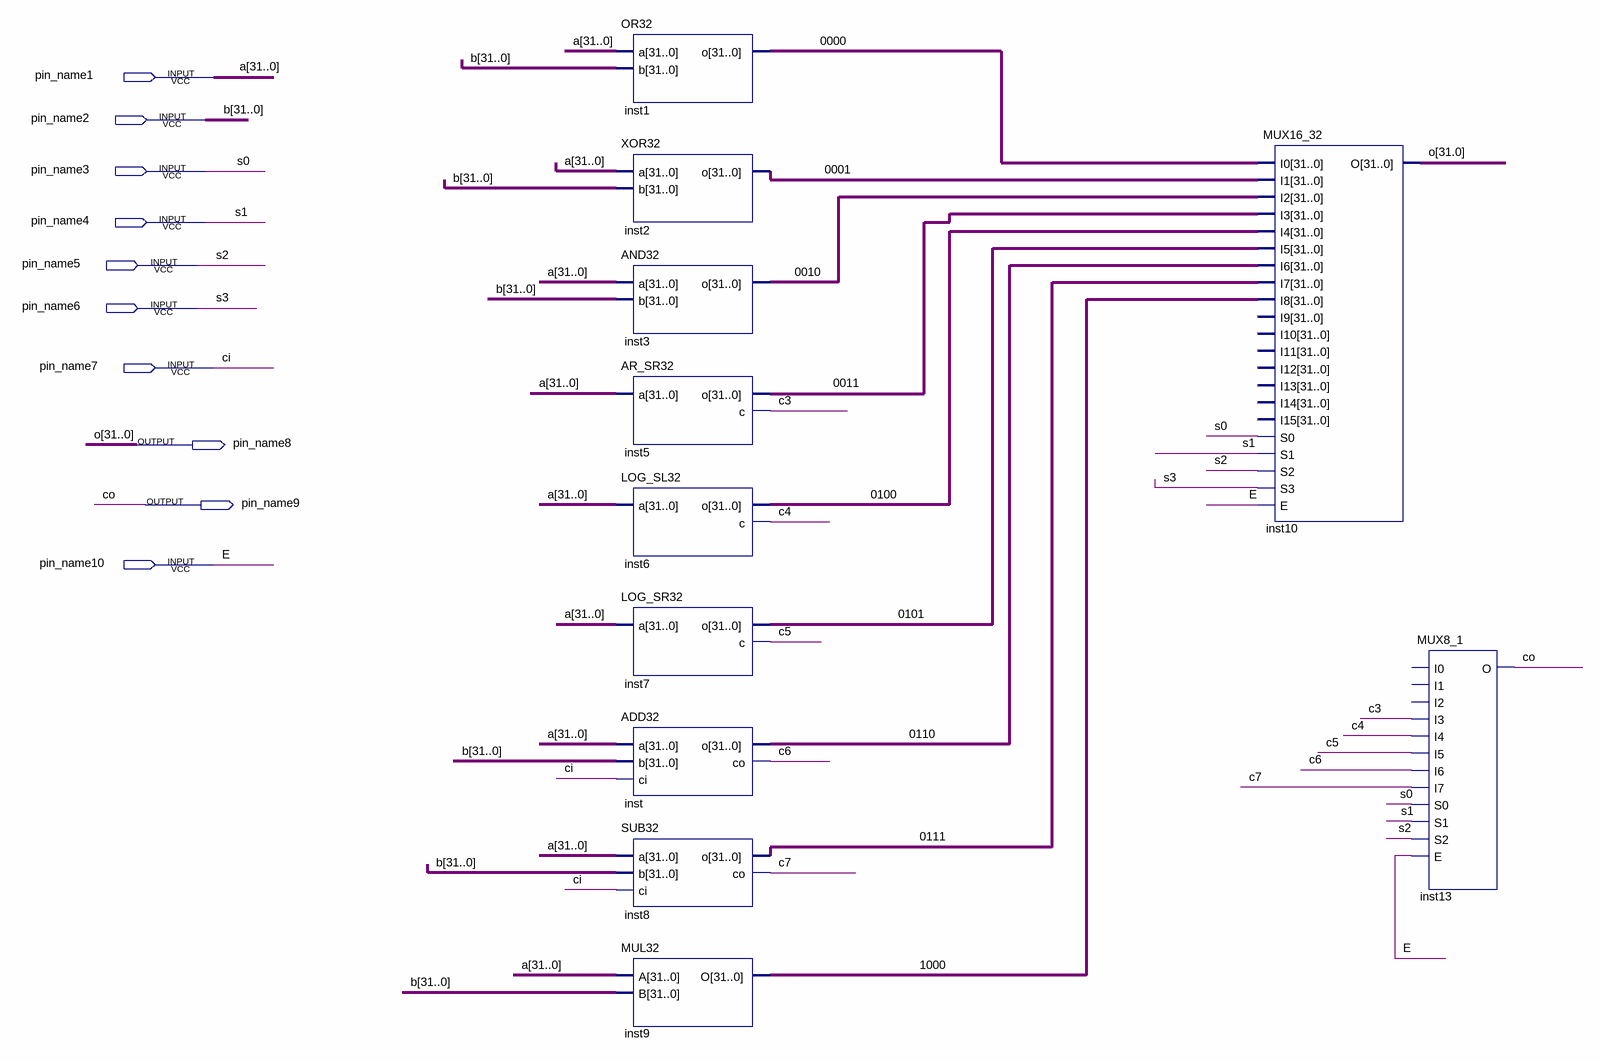
[diagram p0: schematic sheet]
// Quartus schematic ALU32.bdf as structural Verilog: 11 symbols, 10 pins
module ALU32 (
  input  pin_name1,
  input  pin_name2,
  input  pin_name3,
  input  pin_name4,
  input  pin_name5,
  input  pin_name6,
  input  pin_name7,
  input  pin_name10,
  output pin_name8,
  output pin_name9
);

  wire \0000 , \0001 , \0010 , \0011 , \0100 , \0101 , \0110 , \0111 , \1000 , c3, c4, c5, c6, c7, \o[31.0] ;
  wire [31:0] a, b;

  OR32 inst1 (.a(a), .b(b), .o(\0000 ));
  XOR32 inst2 (.a(a), .b(b), .o(\0001 ));
  AND32 inst3 (.a(a), .b(b), .o(\0010 ));
  AR_SR32 inst5 (.a(a), .o(\0011 ), .c(c3));
  LOG_SL32 inst6 (.a(a), .o(\0100 ), .c(c4));
  LOG_SR32 inst7 (.a(a), .o(\0101 ), .c(c5));
  ADD32 inst (.a(a), .b(b), .ci(pin_name7), .o(\0110 ), .co(c6));
  SUB32 inst8 (.a(a), .b(b), .ci(pin_name7), .o(\0111 ), .co(c7));
  MUL32 inst9 (.A(a), .B(b), .O(\1000 ));
  MUX16_32 inst10 (
    .I0({32{\0000 }}), .I1({32{\0001 }}), .I2({32{\0010 }}), .I3({32{\0011 }}), .I4({32{\0100 }}),
    .I5({32{\0101 }}), .I6({32{\0110 }}), .I7({32{\0111 }}), .I8({32{\1000 }}), .S0(pin_name3),
    .S1(pin_name4), .S2(pin_name5), .S3(pin_name6), .E(pin_name10), .O(\o[31.0] ));  // open: I9, I10, I11, I12, I13, I14, I15
  MUX8_1 inst13 (
    .I3(c3), .I4(c4), .I5(c5), .I6(c6), .I7(c7), .S0(pin_name3), .S1(pin_name4), .S2(pin_name5),
    .E(pin_name10), .O(pin_name9));  // open: I0, I1, I2

  // Other names for the same wires on the sheet: ci = pin_name7; co = pin_name9; E = pin_name10; s0 = pin_name3;
  //   s1 = pin_name4; s2 = pin_name5; s3 = pin_name6
endmodule
